# EAGLE design Extruder_Board2.0.0 (EAGLE 9.3.0)
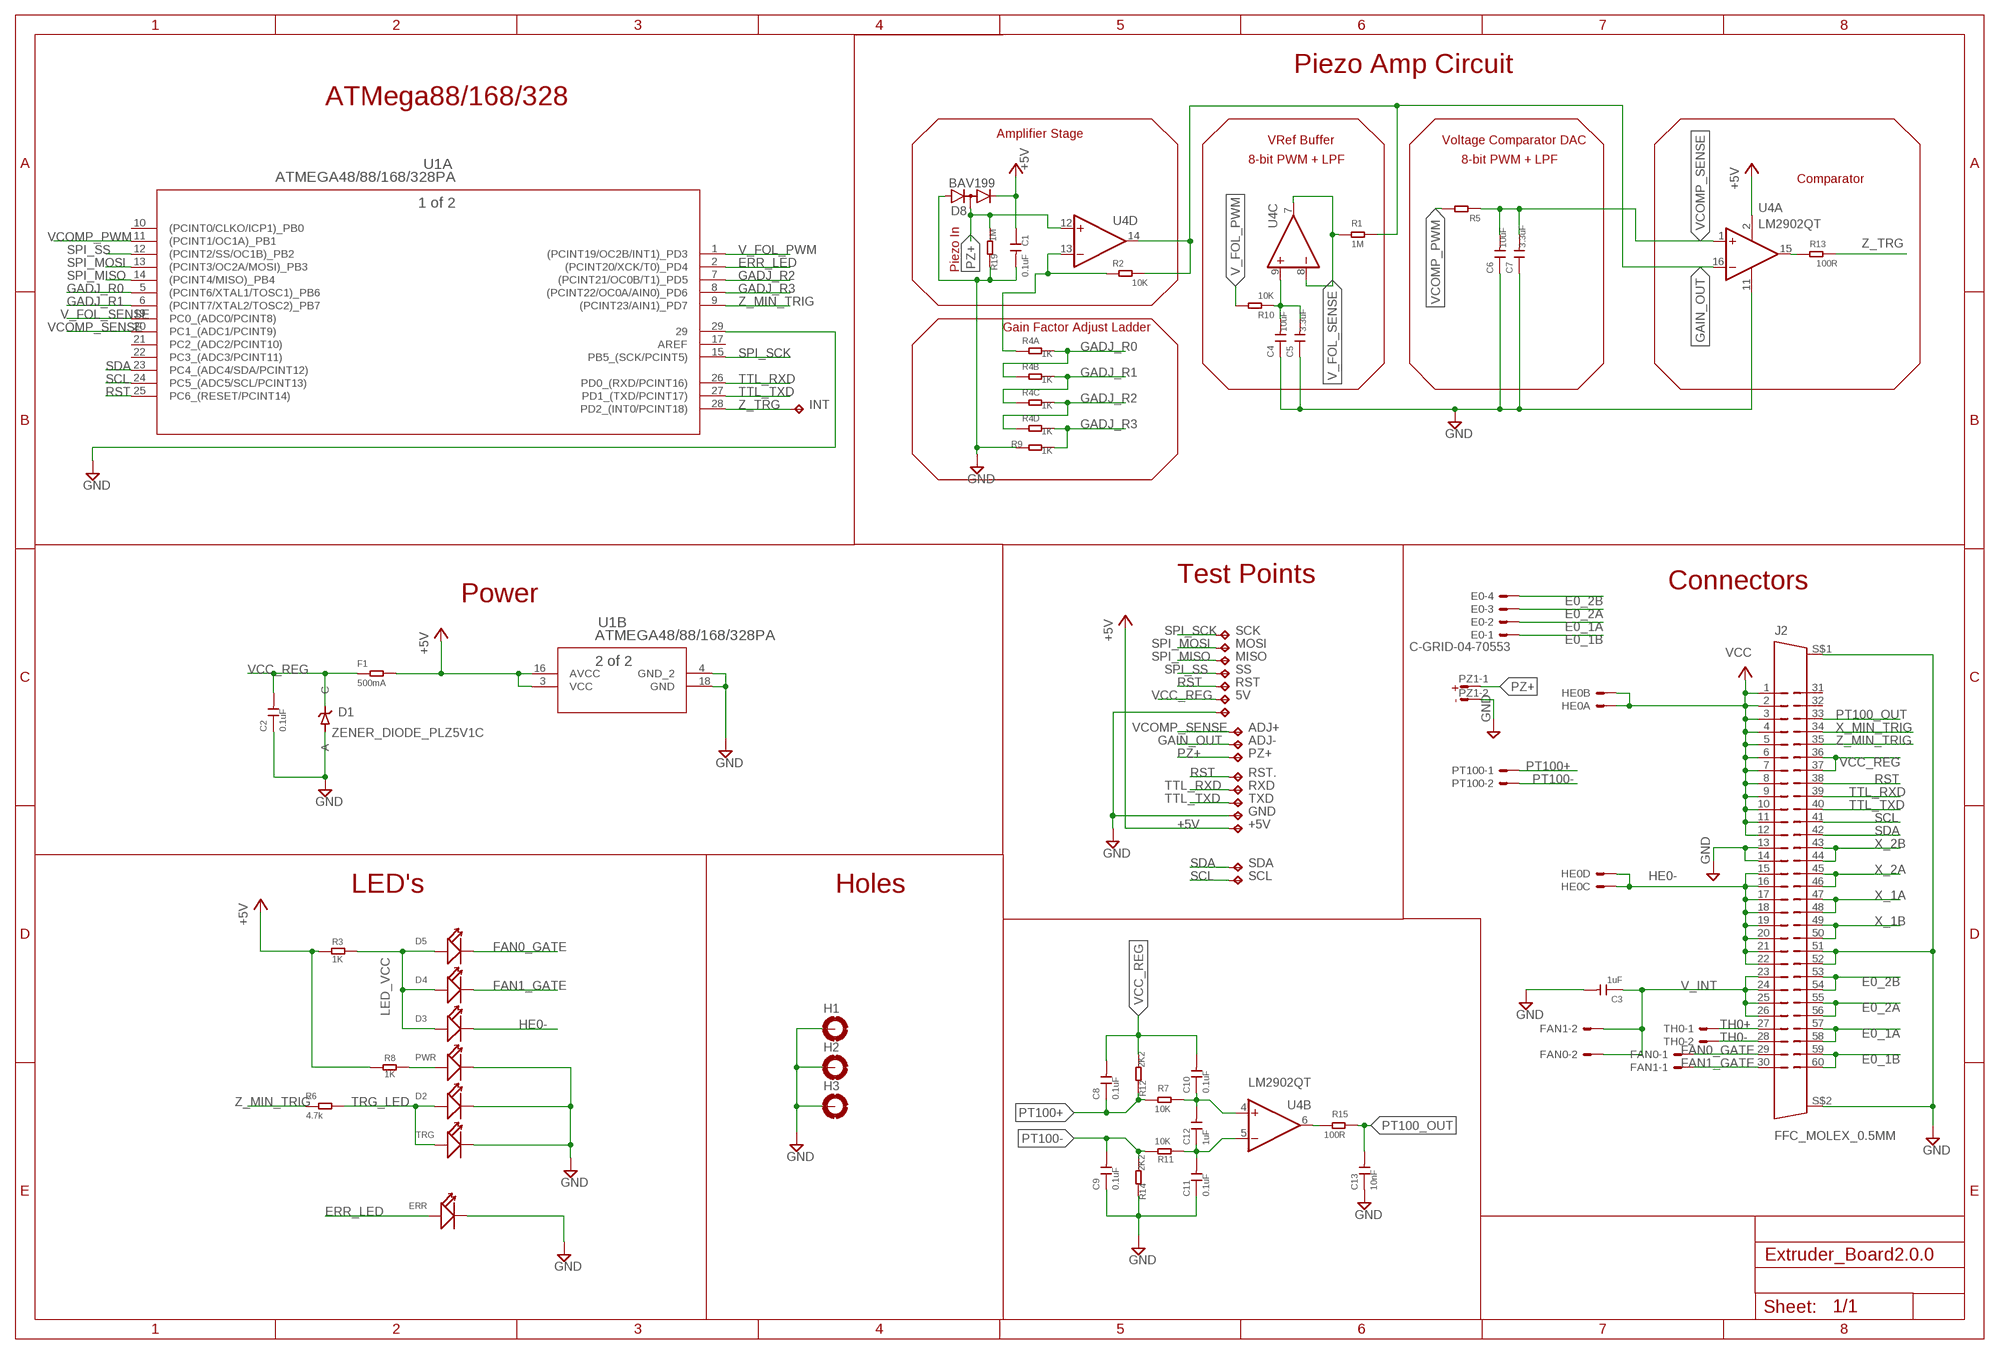
[diagram p0: schematic, sheet 1]

## Parts
5V  TPTP13SQ  [TP13SQ]
+5V  TPTP13SQ  [TP13SQ]
ADJ+  TPTP13SQ  [TP13SQ]
ADJ-  TPTP13SQ  [TP13SQ]
C1  0.1uF  CERAMIC-1NF-50V-10%-X7R(0402)CAP_0402  [CAPC1005X50]
C2  0.1uF  CERAMIC-1NF-50V-10%-X7R(0402)CAP_0402  [CAPC1005X50]
C3  1uF  SEEED-CAPACITOR_CERAMIC-10UF-25V-10%-X5R(0805)CAP_0603_GEN  [CAPC1609X80]
C4  10uF  CERAMIC-1NF-50V-10%-X7R(0402)CAP_0402  [CAPC1005X50]
C5  3.3uF  SEEED-CAPACITOR_CERAMIC-10UF-25V-10%-X5R(0805)CAP_0603_GEN  [CAPC1609X80]
C6  10uF  CERAMIC-1NF-50V-10%-X7R(0402)CAP_0402  [CAPC1005X50]
C7  3.3uF  SEEED-CAPACITOR_CERAMIC-10UF-25V-10%-X5R(0805)CAP_0603_GEN  [CAPC1609X80]
C8  0.1uF  CERAMIC-1NF-50V-10%-X7R(0402)CAP_0402  [CAPC1005X50]
C9  0.1uF  CERAMIC-1NF-50V-10%-X7R(0402)CAP_0402  [CAPC1005X50]
C10  0.1uF  CERAMIC-1NF-50V-10%-X7R(0402)CAP_0402  [CAPC1005X50]
C11  0.1uF  CERAMIC-1NF-50V-10%-X7R(0402)CAP_0402  [CAPC1005X50]
C12  1uF  CERAMIC-1NF-50V-10%-X7R(0402)CAP_0402  [CAPC1005X50]
C13  10nF  CERAMIC-1NF-50V-10%-X7R(0402)CAP_0402  [CAPC1005X50]
D1  ZENER_DIODE_PLZ5V1C  [DO-219AC]
D2  SEEED-LED_SMD-LED-CLEAR-BLUE(0603)LED_0603  [SEEED-LED_LED-0603]
D3  SEEED-LED_SMD-LED-CLEAR-BLUE(0603)LED_0603  [SEEED-LED_LED-0603]
D4  SEEED-LED_SMD-LED-CLEAR-BLUE(0603)LED_0603  [SEEED-LED_LED-0603]
D5  SEEED-LED_SMD-LED-CLEAR-BLUE(0603)LED_0603  [SEEED-LED_LED-0603]
D8  BAV199  [SOT23]
E0  C-GRID-04-70553  [70553-04]
ERR  SEEED-LED_SMD-LED-CLEAR-BLUE(0603)LED_0603  [SEEED-LED_LED-0603]
F1  500mA  SEEED-RESISTOR_SMD-RES-1.5K-1%-1/10W(0603)DETAILED_MODEL  [SEEED-RESISTOR_R0603]
FAN0  CON-MOLEX-2P-1.27MM048  [53048-02]
FAN1  CON-MOLEX-2P-1.27MM048  [53048-02]
GND  TPTP13SQ  [TP13SQ]
H1  HOLES_MOUNT-PAD-ROUND3.2  [HOLES_3,2-PAD]
H2  HOLES_MOUNT-PAD-ROUND3.2  [HOLES_3,2-PAD]
H3  HOLES_MOUNT-PAD-ROUND3.2  [HOLES_3,2-PAD]
HE0  JST-2.54-2X2JST-DUPONT-2.54-2X2  [HDRRAR4W64P254_2X2_556X736X556B]
INT  TPTP06R  [TP06R]
J2  FFC_MOLEX_0.5MM  [FFC-60P_0.5_MOLEX_505110-6091]
MISO  TPTP13SQ  [TP13SQ]
MOSI  TPTP13SQ  [TP13SQ]
PT100  CON-MOLEX-2P-1.27MM048  [53048-02]
PWR  SEEED-LED_SMD-LED-CLEAR-BLUE(0603)LED_0603  [SEEED-LED_LED-0603]
PZ1  CON-MOLEX-2P-1.27MM048  [53048-02]
PZ+  TPTP13SQ  [TP13SQ]
R1  1M  SMD-RES-0R-5%-1/16W(0402)  [R0402]
R2  10K  SMD-RES-0R-5%-1/16W(0402)  [R0402]
R3  1K  SMD-RES-0R-5%-1/16W(0402)  [R0402]
R4  1K  RESISTOR_NETWORK_X40804  [EXBN8V]
R5  10K  SEEED-RESISTOR_SMD-RES-1.5K-1%-1/10W(0603)DETAILED_MODEL  [SEEED-RESISTOR_R0603]
R6  4.7k  SMD-RES-0R-5%-1/16W(0402)  [R0402]
R7  10K  SMD-RES-0R-5%-1/16W(0402)  [R0402]
R8  1K  SMD-RES-0R-5%-1/16W(0402)  [R0402]
R9  1K  SMD-RES-0R-5%-1/16W(0402)  [R0402]
R10  10K  SMD-RES-0R-5%-1/16W(0402)  [R0402]
R11  10K  SMD-RES-0R-5%-1/16W(0402)  [R0402]
R12  2K2  SMD-RES-0R-5%-1/16W(0402)  [R0402]
R13  100R  SMD-RES-0R-5%-1/16W(0402)  [R0402]
R14  2K2  SMD-RES-0R-5%-1/16W(0402)  [R0402]
R15  100R  SMD-RES-0R-5%-1/16W(0402)  [R0402]
R19  1M  SMD-RES-0R-5%-1/16W(0402)  [R0402]
RST  TPTP13SQ  [TP13SQ]
RST.  TPTP13SQ  [TP13SQ]
RXD  TPTP13SQ  [TP13SQ]
SCK  TPTP13SQ  [TP13SQ]
SCL  TPTP13SQ  [TP13SQ]
SDA  TPTP13SQ  [TP13SQ]
SS  TPTP06R  [TP06R]
TH0  CON-MOLEX-2P-1.27MM048  [53048-02]
TRG  SEEED-LED_SMD-LED-CLEAR-BLUE(0603)LED_0603  [SEEED-LED_LED-0603]
TXD  TPTP13SQ  [TP13SQ]
U1  ATMEGA48/88/168/328PA  [28M1]
U4  LM2902QT  [QFN16]
⏚  TPTP13SQ  [TP13SQ]

## Nets
+5V: +5V.TP C1.1 D8.2(C) F1.2 R3.1 R8.1 U1.3(B:VCC) U1.16(B:AVCC) U4.2(P:V+)
E0_1A: E0.2 J2.57 J2.58
E0_1B: E0.1 J2.59 J2.60
E0_2A: E0.3 J2.55 J2.56
E0_2B: E0.4 J2.53 J2.54
ERR_LED: ERR.+ U1.2(A:(PCINT20/XCK/T0)_PD4)
FAN0_GATE: D5.- FAN0.1 J2.29
FAN1_GATE: D4.- FAN1.1 J2.30
GADJ_R0: R4.2 R4.8 U1.5(A:(PCINT6/XTAL1/TOSC1)_PB6)
GADJ_R1: R4.3 R4.7 U1.6(A:(PCINT7/XTAL2/TOSC2)_PB7)
GADJ_R2: R4.4 R4.6 U1.7(A:(PCINT21/OC0B/T1)_PD5)
GADJ_R3: R4.5 R9.2 U1.8(A:(PCINT22/OC0A/AIN0)_PD6)
GAIN_FB: R2.1 R4.1 U4.13(D:-IN)
GAIN_OUT: ADJ-.TP R1.2 R2.2 U4.14(D:OUT) U4.16(A:-IN)
GND: C1.2 C2.1 C3.2 C4.1 C5.1 C6.1 C7.1 C9.1 C11.1 C13.1 D1.P$1(A) D2.- D8.1(A) ERR.- GND.TP H1.B3,2(MOUNT) H2.B3,2(MOUNT) H3.B3,2(MOUNT) J2.13 J2.14 J2.51 J2.52 J2.S$1(S) J2.S$2(S) PWR.- PZ1.2 R9.1 R14.1 R19.1 TRG.- U1.4(B:GND_2) U1.18(B:GND) U1.29 U4.11(P:V-) ⏚.TP
HE0-: D3.- HE0.3 HE0.4 J2.15 J2.16 J2.17 J2.18 J2.19 J2.20 J2.21 J2.22
LED_VCC: D3.+ D4.+ D5.+ R3.2
N$2: PWR.+ R8.2
PT100+: C8.1 PT100.1 R7.2 R12.1
PT100-: C9.2 PT100.2 R11.2 R14.2
PT100_AMP+: C10.1 C12.2 R7.1 U4.4(B:+IN)
PT100_AMP-: C11.2 C12.1 R11.1 U4.5(B:-IN)
PT100_OUT: C13.2 J2.33 R15.1
PT100_R: R15.2 U4.6(B:OUT)
PZ+: D8.3(AC) PZ1.1 PZ+.TP R19.2 U4.12(D:+IN)
PZ_AMP_OUT: R13.1 U4.15(A:OUT)
RST: J2.38 RST..TP RST.TP U1.25(A:PC6_(RESET/PCINT14))
SCL: J2.41 SCL.TP U1.24(A:PC5_(ADC5/SCL/PCINT13))
SDA: J2.42 SDA.TP U1.23(A:PC4_(ADC4/SDA/PCINT12))
SPI_MISO: MISO.TP U1.14(A:(PCINT4/MISO)_PB4)
SPI_MOSI: MOSI.TP U1.13(A:(PCINT3/OC2A/MOSI)_PB3)
SPI_SCK: SCK.TP U1.15(A:PB5_(SCK/PCINT5))
SPI_SS: SS.TP U1.12(A:(PCINT2/SS/OC1B)_PB2)
TH0+: J2.27 TH0.1
TH0-: J2.28 TH0.2
TRG_LED: D2.+ R6.2 TRG.+
TTL_RXD: J2.39 RXD.TP U1.26(A:PD0_(RXD/PCINT16))
TTL_TXD: J2.40 TXD.TP U1.27(A:PD1_(TXD/PCINT17))
V_FOL_PWM: R10.2 U1.1(A:(PCINT19/OC2B/INT1)_PD3)
V_FOL_SENSE: R1.1 U1.19(A:PC0_(ADC0/PCINT8)) U4.7(C:OUT) U4.8(C:-IN)
V_INT: C3.1 FAN0.2 FAN1.2 J2.23 J2.24 J2.25 J2.26
VCC: HE0.1 HE0.2 J2.1 J2.2 J2.3 J2.4 J2.5 J2.6 J2.7 J2.8 J2.9 J2.10 J2.11 J2.12
VCC_REG: 5V.TP C2.2 C8.2 C10.2 D1.P$2(C) F1.1 J2.36 J2.37 R12.2
VCOMP_PWM: R5.2 U1.11(A:(PCINT1/OC1A)_PB1)
VCOMP_SENSE: ADJ+.TP C6.2 C7.2 R5.1 U1.20(A:PC1_(ADC1/PCINT9)) U4.1(A:+IN)
VREF_IN: C4.2 C5.2 R10.1 U4.9(C:+IN)
X_1A: J2.47 J2.48
X_1B: J2.49 J2.50
X_2A: J2.45 J2.46
X_2B: J2.43 J2.44
X_MIN_TRIG: J2.34
Z_MIN_TRIG: J2.35 R6.1 U1.9(A:(PCINT23/AIN1)_PD7)
Z_TRG: INT.TP R13.2 U1.28(A:PD2_(INT0/PCINT18))
Unconnected: J2.31 J2.32 U1.10(A:(PCINT0/CLKO/ICP1)_PB0) U1.17(A:AREF) U1.21(A:PC2_(ADC2/PCINT10)) U1.22(A:PC3_(ADC3/PCINT11))

## Notes on the sheet
- Piezo Amp Circuit
- ATMega88/168/328
- Amplifier Stage
- VRef Buffer | Voltage Comparator DAC
- 8-bit PWM + LPF | 8-bit PWM + LPF
- Comparator
- Piezo In
- Gain Factor Adjust Ladder
- Test Points | Connectors
- Power
- -  +
- LED's | Holes

## Library data of the parts
5V ADJ+ ADJ- MISO MOSI PZ+ RST SCK = PiezoFFC:TP: Test pad
+5V GND INT RST. RXD SCL SDA SS TXD ⏚ = testpad:TP: Test pad
C1 C2 C4 C6 C8-C13 = PiezoFFC:CERAMIC-1NF-50V-10%-X7R(0402): 302010005
C3 C5 C7 = PiezoFFC:SEEED-CAPACITOR_CERAMIC-10UF-25V-10%-X5R(0805): 302010178
D1 = PiezoFFC:ZENER_DIODE_PLZ5V1C
D2-D5 ERR PWR TRG = PiezoFFC:SEEED-LED_SMD-LED-CLEAR-BLUE(0603): 304090045
D8 = PiezoFFC:BAV199: DIODE low-leakage double diode
E0 = PiezoFFC:C-GRID-04: CONNECTOR wire to board 2.54 mm (0.100") pitch header; MF: MOLEX; OC_FARNELL: unknown; OC_NEWARK: unknown
F1 R5 = PiezoFFC:SEEED-RESISTOR_SMD-RES-1.5K-1%-1/10W(0603): 301010189
FAN0 FAN1 PT100 PZ1 TH0 = PiezoFFC:CON-MOLEX-2P-1.27MM: CONNECTOR wire to board 1.25 mm (.049 inch) pitch header; MF: MOLEX; MPN: 53048-0210; OC_FARNELL: 1012259; OC_NEWARK: 57H4718
H1-H3 = PiezoFFC:HOLES_MOUNT-PAD-ROUND: MOUNTING PAD, round
HE0 = PiezoFFC:JST-2.54-2X2
J2 = PiezoFFC:FFC_MOLEX_0.5MM
R1-R3 R6-R15 R19 = PiezoFFC:SMD-RES-0R-5%-1/16W(0402): 301010000; MPN: RC0402JR-070RL; VALUE: 0R
R4 = PiezoFFC:RESISTOR_NETWORK_X4
U1 = PiezoFFC:ATMEGA48/88/168/328PA; MANUFACTURER_PART_NUMBER: ATMEGA48PAMMHR; VENDOR: Atmel
U4 = PiezoFFC:LM2902: Low power quad operational amplifier Source: Data sgeet <http://www.st.com/internet/com/TECHNICAL_RESOURCES/TECHNICAL_LITERATURE/DATASHEET/CD00000533.pdf>

## Board
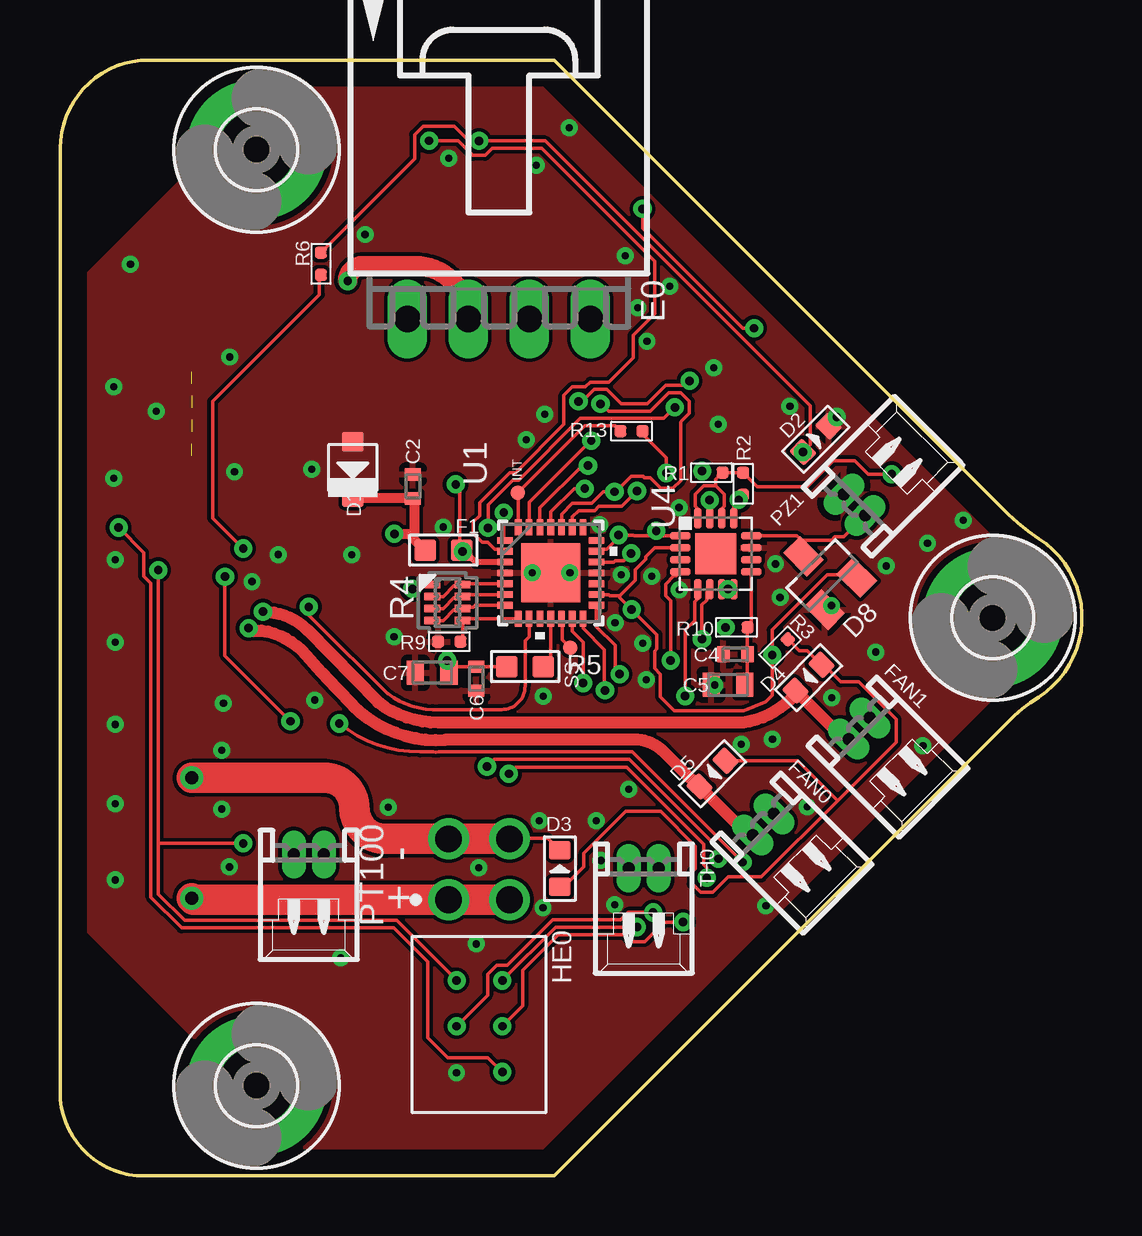
[diagram p1: board, top side]
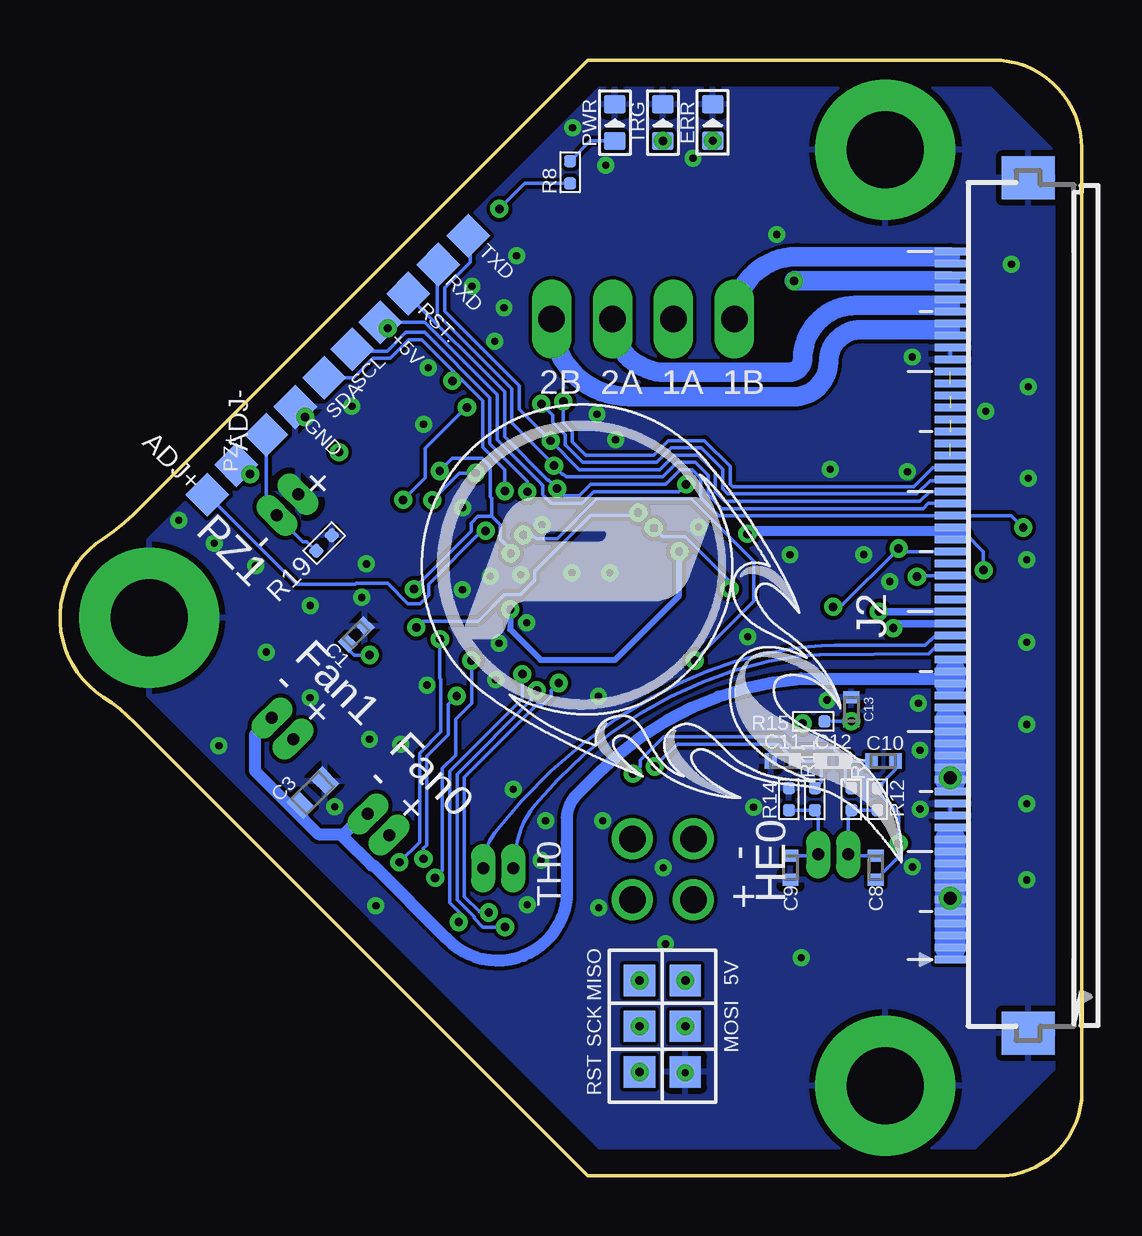
[diagram p2: board, bottom side, seen from below]

Size 42.58 x 46.48 mm. Coordinates in mm from the lower left corner, seen from the top.
Outline: 22.46,1.87 39.46,18.87 arc-12 40.78,19.94 arc114 40.78,26.54 arc-12 39.51,27.56 20.59,46.48 8.14,46.48 3.7,46.48 arc90 0.01,42.8 0.01,3.81 arc90 3.19,0 8.27,0 20.59,0 22.46,1.87
Copper layers (1*16): Top 0.035mm / dielectric 1.5mm / Bottom 0.035mm
Design rules "default *": minimum track width 6mil, minimum drill 0.35mm, track to track 6mil, track to pad 6mil, pad to pad 6mil, via to via 6mil, smd to smd 6mil, copper to edge 40mil, drill to drill 6mil, minimum pad ring 10mil, minimum via ring 8mil, stop-mask expansion 4mil, vias tented up to drill 4mm, thermal gap 10mil

### Footprints (pad centres in the part's own frame; a part is rotated, then mirrored left to right if it is on the bottom)
TP13SQ = smd 1.3 x 1.3: TP 0,0
CAPC1005X50 = smd 0.512 x 0.662: 1 -0.5,0; 2 0.5,0
CAPC1609X80 = smd 0.712 x 1.012: 1 -0.7,0; 2 0.7,0
DO-219AC = smd 0.8 x 0.9: P$1 -1.15,0; P$2 1.15,0
SEEED-LED_LED-0603 = smd 0.762 x 0.889: + -0.762,0; - 0.762,0
SOT23 = smd 1 x 1.4: 1 -0.95,-1.1; 2 0.95,-1.1; 3 0,1.1
70553-04 = drill 1.092 long: 1 -3.81,-7.62; 2 -1.27,-7.62; 3 1.27,-7.62; 4 3.81,-7.62
SEEED-RESISTOR_R0603 = smd 0.889 x 0.889: 1 0,0.762; 2 0,-0.762
53048-02 = drill 0.5 pad 0.698 long: 1 0.625,-1.25; 2 -0.625,-1.25
HOLES_3,2-PAD = drill 3.2 pad 5.842: B3,2 0,0
HDRRAR4W64P254_2X2_556X736X556B = drill 1.105 pad 1.705: 1 0,0; 2 2.54,0; 3 2.54,2.54; 4 0,2.54
TP06R = smd 0.6 x 0.6: TP 0,0
FFC-60P_0.5_MOLEX_505110-6091 = smd 0.3 x 1.3: 1 -14.75,3.25; 2 -14.25,3.25; 3 -13.75,3.25; 4 -13.25,3.25; 5 -12.75,3.25; 6 -12.25,3.25; 7 -11.75,3.25; 8 -11.25,3.25; 9 -10.75,3.25; 10 -10.25,3.25; 11 -9.75,3.25; 12 -9.25,3.25; 13 -8.75,3.25; 14 -8.25,3.25; 15 -7.75,3.25; 16 -7.25,3.25; 17 -6.75,3.25; 18 -6.25,3.25; 19 -5.75,3.25; 20 -5.25,3.25; 21 -4.75,3.25; 22 -4.25,3.25; 23 -3.75,3.25; 24 -3.25,3.25; 25 -2.75,3.25; 26 -2.25,3.25; 27 -1.75,3.25; 28 -1.25,3.25; 29 -0.75,3.25; 30 -0.25,3.25; 31 0.25,3.25; 32 0.75,3.25; 33 1.25,3.25; 34 1.75,3.25; 35 2.25,3.25; 36 2.75,3.25; 37 3.25,3.25; 38 3.75,3.25; 39 4.25,3.25; 40 4.75,3.25; 41 5.25,3.25; 42 5.75,3.25; 43 6.25,3.25; 44 6.75,3.25; 45 7.25,3.25; 46 7.75,3.25; 47 8.25,3.25; 48 8.75,3.25; 49 9.25,3.25; 50 9.75,3.25; 51 10.25,3.25; 52 10.75,3.25; 53 11.25,3.25; 54 11.75,3.25; 55 12.25,3.25; 56 12.75,3.25; 57 13.25,3.25; 58 13.75,3.25; 59 14.25,3.25; 60 14.75,3.25 | smd 1.8 x 2.2: S$1 17.821,0; S$2 -17.821,0
R0402 = smd 0.5 x 0.5: 1 0,0.463; 2 0,-0.463
EXBN8V = smd 0.657 x 0.3: 1 -0.629,0.75; 2 -0.629,0.25; 3 -0.629,-0.25; 4 -0.629,-0.75; 5 0.629,-0.75; 6 0.629,-0.25; 7 0.629,0.25; 8 0.629,0.75
28M1-L = smd 0.66 x 0.279: 1 -1.905,1.35; 2 -1.905,0.9; 3 -1.905,0.45; 4 -1.905,0; 5 -1.905,-0.45; 6 -1.905,-0.9; 7 -1.905,-1.35; 15 1.905,-1.35; 16 1.905,-0.9; 17 1.905,-0.45; 18 1.905,0; 19 1.905,0.45; 20 1.905,0.9; 21 1.905,1.35 | smd 0.279 x 0.66: 8 -1.35,-1.905; 9 -0.9,-1.905; 10 -0.45,-1.905; 11 0,-1.905; 12 0.45,-1.905; 13 0.9,-1.905; 14 1.35,-1.905; 22 1.35,1.905; 23 0.9,1.905; 24 0.45,1.905; 25 0,1.905; 26 -0.45,1.905; 27 -0.9,1.905; 28 -1.35,1.905 | smd 2.464 x 2.464: 29 0,0
QFN16 = smd 0.85 x 0.3: 1 -1.475,0.75; 2 -1.475,0.25; 3 -1.475,-0.25; 4 -1.475,-0.75; 9 1.475,-0.75; 10 1.475,-0.25; 11 1.475,0.25; 12 1.475,0.75 | smd 0.3 x 0.85: 5 -0.75,-1.475; 6 -0.25,-1.475; 7 0.25,-1.475; 8 0.75,-1.475; 13 0.75,1.475; 14 0.25,1.475; 15 -0.25,1.475; 16 -0.75,1.475 | smd 1.7 x 1.7: TH 0,0

### Placement (x,y rotation side)
5V  16.52,8.13 0 bottom
+5V  29.24,35.56 135 bottom
ADJ+  36.45,28.36 45 bottom
ADJ-  35.23,29.61 225 bottom
C1  30.24,22.54 45 bottom
C2  14.71,28.71 270 top
C3  32.05,15.94 45 bottom
C4  28.14,21.72 0 top
C5  27.83,20.45 0 top
C6  17.35,20.7 90 top
C7  15.51,20.96 0 top
C8  8.59,12.83 270 bottom
C9  12.14,12.83 90 bottom
C10  8.27,17.27 0 bottom
C11  12.46,17.27 0 bottom
C12  10.36,17.27 0 bottom
C13  9.6,19.43 270 bottom
D1  12.2,29.43 270 top
D2  31.49,30.68 45 top
D3  20.83,12.79 90 top
D4  31.19,20.75 225 top
D5  27.19,16.75 225 top
D8  31.75,25.02 45 top
E0  18.29,43.31 0 top
ERR  15.38,43.88 90 bottom
F1  15.97,26.06 90 top
FAN0  30.19,13.75 225 top
FAN1  34.19,17.75 225 top
GND  32.78,32.02 315 bottom
H1  8.19,3.75 0 top
H2  8.19,42.75 0 top
H3  38.86,23.24 0 top
HE0  16.19,11.49 0 top
INT  19.08,28.45 180 top
J2  2.24,23.75 90 bottom
MISO  18.43,8.13 0 bottom
MOSI  16.52,6.22 0 bottom
PT100  10.36,12.13 180 top
PWR  19.46,43.87 90 bottom
PZ1  33.99,28.83 315 top
PZ+  33.99,30.86 45 bottom
R1  27.14,29.29 90 top
R2  28.46,28.83 180 top
R3  30.01,22.02 135 top
R4  16.14,23.88 0 top
R5  19.38,21.21 90 top
R6  10.87,37.99 180 top
R7  9.6,15.68 0 bottom
R8  21.32,41.8 180 bottom
R9  16.22,22.24 90 top
R10  28.19,22.84 270 top
R11  11.13,15.68 0 bottom
R12  8.52,15.68 180 bottom
R13  23.81,31.02 270 top
R14  12.21,15.68 0 bottom
R15  11.19,18.92 270 bottom
R19  31.57,26.35 315 bottom
RST  18.43,4.32 0 bottom
RST.  28.07,36.75 315 bottom
RXD  26.82,37.96 135 bottom
SCK  18.43,6.22 0 bottom
SCL  30.41,34.42 315 bottom
SDA  31.57,33.24 315 bottom
SS  21.27,21.99 90 top
TH0  24.32,11.56 180 top
TRG  17.46,43.87 90 bottom
TXD  25.57,39.16 135 bottom
U1  ATMEGA48PA-MMHR28M1-L  [28M1-L]  20.45,25.11 0 top
U4  27.32,25.91 0 top
U$1  [LOGO-PYR0BALL-SS-20MM]  20.73,25.51 0 bottom
⏚  16.52,4.32 0 bottom

### Tracks (layer width: path | path; a pad name or v marks a point on that pad's centre or on a via)
+5V  (via drill 0.35)
  Top 0.152: 28.84,35.31 v28.92,35.31 28.45,35.31 24.27,39.48 v24.27,40.28 | D8.2 33.08,25.04 31.98,25.04 29.68,22.74 R3.1 29.68,20.01 29.41,19.75 28.49,19.37 25.6,19.37 25.01,19.96 25.01,20.9 24.78,21.13 24.78,21.85 24.87,21.94 24.87,22.54 v23.82,23.59 23.33,24.08 | U1.16 22.86,24.21 22.91,24.15 23.25,24.15 23.33,24.08 | v16.49,28.8 16.65,28.64 16.65,26.06 | U4.2 24.78,26.16 24.4,25.79 24.4,25.67 23.96,25.23 23.96,24.8 23.33,24.16 23.33,24.08
  Top 0.254: U1.3 17.32,25.56 16.82,26.06 F1.2 | F1.2 16.65,26.06 | v16.78,26 F1.2
  Bottom 0.152: 22.49,28.79 24.36,30.65 24.36,32.53 27.39,35.56 28.67,35.56 v28.92,35.31 28.99,35.31 +5V.TP | v24.27,40.28 23.22,41.34 R8.1 | 29.59,21.69 R3.1 30.32,21.69 30.61,21.98 30.61,22.17 C1.1 | 22.49,28.79 22.5,28.78 | 22.49,28.79 22.47,28.77 22.47,28.37 22.12,28.02 20.82,28.02 20.33,28.5 16.79,28.5 v16.49,28.8
  Bottom 0.254: v23.82,23.59 23.82,22.76 22.55,21.49 19.45,21.49 16.78,24.16 v16.78,26
  other vias: 29.68,21.69
E0_1A  (via drill 0.35)
  Top 0.813: E0.2 arc90 14.79,37.91 12.62,37.91 arc90 v11.99,37.27
  Bottom 0.152: J2.57 5.49,37.27 J2.58
  Bottom 0.813: v11.99,37.27 arc-90 v11.99,37.27 5.49,37.27
E0_1B
  Bottom 0.152: J2.59 5.49,38.29 J2.60
  Bottom 0.813: E0.1 arc90 11.87,38.29 5.49,38.29
E0_2A
  Bottom 0.152: J2.55 5.49,36.26 J2.56
  Bottom 0.813: E0.3 arc-90 17.34,33.46 12.21,33.46 arc-90 11.63,34.04 arc90 9.41,36.26 5.49,36.26
E0_2B
  Bottom 0.152: J2.53 5.49,35.24 J2.54
  Bottom 0.813: E0.4 arc-90 18.86,32.45 12.02,32.45 arc-90 10.56,33.91 arc90 9.22,35.24 5.49,35.24
ERR_LED  (via drill 0.35)
  Top 0.152: ERR.+ 16.6,43.12 17.21,42.5 17.71,42.5 18.01,42.81 20.07,42.81 24.78,38.1 24.78,35.91 23.88,35.01 23.88,34.07 22.87,33.06 22.09,33.06 21.89,32.86 21.35,32.86 21,32.51 21,31.3 18.99,29.28 18.73,29.28 17.48,28.04 17.48,27.49 17.23,27.24 17.23,26.74 17.58,26.38 17.83,26.38 18.12,26.09 18.46,26.09 U1.2
  other vias: 15.38,43.12
FAN0_GATE  (via drill 0.35)
  Top 0.508: FAN0.1 28.67,14.19 D5.- 26.18,16.64 25.16,17.65 arc50 23.76,18.16 16.08,18.16 arc-49 12.2,19.59 arc-5 10.25,21.69 arc41 8.4,22.71 7.86,22.71 v7.86,22.81
  Bottom 0.305: J2.29 7.67,23 v7.86,22.81
FAN1_GATE  (via drill 0.35)
  Top 0.508: FAN1.1 32.67,18.19 D4.- 30.65,20.06 30.46,19.87 arc-37 28.46,18.87 15.77,18.87 arc-37 13.26,19.71 arc1 10.3,22.74 arc45 v8.46,23.5
  Bottom 0.305: J2.30 6.49,23.5 arc0 v8.46,23.5
GADJ_R0
  Top 0.152: U1.5 16.81,24.66 R4.8 16.71,24.57 16.41,24.57 15.97,24.13 R4.2
GADJ_R1
  Top 0.152: U1.6 18.52,24.19 16.84,24.19 R4.7 16.71,24.07 16.41,24.07 15.97,23.63 R4.3
GADJ_R2
  Top 0.152: U1.7 17.3,23.76 17.23,23.69 16.84,23.69 R4.6 16.71,23.57 16.41,23.57 15.97,23.13 R4.4
GADJ_R3
  Top 0.152: U1.8 16.85,23.21 R4.5 16.77,22.34 R9.2
GAIN_FB  (via drill 0.35)
  Top 0.152: U4.13 28.07,27.97 R2.1 28.46,28.33 v28.28,28.15 | v25.62,32.01 25.16,31.55 21.68,31.55 19.11,28.98 18.86,28.98 17.84,27.96 v17.84,26.99 | R4.1 14.86,24.63 v14.68,24.45
  Bottom 0.152: v28.28,28.15 27.36,29.07 27.36,30.3 25.65,32.01 v25.62,32.01 | v17.84,26.99 17.46,26.61 16.53,26.61 14.71,24.8 14.71,24.48 v14.68,24.45
GAIN_OUT  (via drill 0.35)
  Top 0.152: 27.32,28.75 26.82,28.75 26.46,28.39 26.46,27.89 26.57,27.78 U4.16 | 27.32,28.75 27.68,28.39 27.68,27.89 27.57,27.78 U4.14 | 27.32,28.75 27.32,29 R1.2 R2.2 29.05,28.7 31.13,28.7 32.21,29.78 33.12,29.78 33.67,29.23 v34.66,29.23
  Bottom 0.152: ADJ-.TP 35.04,29.61 v34.66,29.23
GND  (via drill 0.3, 0.35)
  Bottom 0.152: J2.13 J2.14 | J2.52 J2.51
  other vias: 23.38,25.04 27.43,31.31 23.56,38.33 21.25,25.12 10.49,29.43 35.96,17.91 29.68,18.18 2.94,37.97 36.15,26.35 2.3,25.65 2.3,22.23 2.3,18.8 2.3,15.49 2.3,12.32 11.7,9.08 6.75,17.72 8,24.75 15.97,27.02 12.16,25.86 20.2,31.72 19.97,14.78 24.29,22.18 22.35,14.78 21.22,43.66 28.38,17.97 24.43,20.66 31.13,15.37 29.41,11.24 23.13,23.03 27.29,20.44 17.44,12.83 37.64,27.3 19.84,42.1 27.24,33.65 30.41,32.05 19.67,25.12 32.16,19.91 7.07,34.11 7.27,29.33 32.37,31.61 19.43,30.66 34.43,25.4 22.49,27.11 32.15,23.75 24.65,24.98 25.79,27.83 29.81,25.49 30,24.09 25.81,24.41 9.09,25.88 4.01,31.85 13.92,22.45 20.14,19.97 23.7,16.1 6.74,15.27 7.06,12.86 24.46,34.77 16.2,42.39 12.71,39.21 33.98,21.81 6.81,19.69 10.62,19.81 24.08,36.16 25.41,37.05 2.23,29.05 2.23,32.86 16.52,4.29 17.35,9.65 22.54,13.13 23.11,11.29 20.12,11.16 13.68,15.35
  pour Top: 1.01,37.43 1.01,10.32 10.46,0.87 20.46,0.87 39.46,19.87 39.46,26.87 20.46,45.87 9.46,45.87
  pour Bottom: 1.01,42.51 1.01,4.6 4.47,1.14 20.08,1.14 39.26,20.32 39.26,26.16 20.08,45.34 3.84,45.34
HE0-  (via drill 0.55)
  Top 0.152: D3.- 20.32,14.06 18.76,14.06 HE0.3
  Top 1.27: HE0.3 HE0.4 13.54,14.03 arc-90 12.27,15.3 arc90 11,16.57 v5.49,16.57
  Bottom 0.152: J2.15 J2.16 | v5.49,16.57 J2.17 J2.18 J2.19 J2.20 J2.21 J2.22
  Bottom 1.27: J2.16 v5.49,16.57 J2.21
LED_VCC
  Top 0.152: D5.+ 30.74,17.29 32.4,15.62 | 32.4,15.62 34.84,18.06 34.84,19.02 33.28,20.57 32.53,20.57 31.82,21.29 D4.+ 31.14,21.87 30.81,21.87 R3.2 | 32.4,15.62 29.22,12.45 27.85,12.45 27.2,11.8 26.7,11.8 26.34,12.15 26.34,12.65 26.47,12.79 26.47,13.73 25.02,15.18 23.57,15.18 21.83,13.43 21.83,12.86 21,12.03 D3.+
N$2
  Bottom 0.152: 19.21,42.86 PWR.+ 20.48,43.11 R8.2
PT100+
  Bottom 0.152: C8.1 9.69,13.33 PT100.1 9.74,15.08 R7.2 R12.1
PT100-
  Bottom 0.152: C9.2 11.04,13.33 PT100.2 10.99,15.08 R11.2 R14.2
PT100_AMP+  (via drill 0.35)
  Top 0.152: U4.4 25.67,24.99 25.57,24.99 25.23,24.65 25.23,24.17 25.44,23.95 v25.44,21.46 | v26.95,12.4 26.95,12.83 26.83,12.95 26.83,13.81 23.61,17.02 18.98,17.02 v18.7,16.74
  Bottom 0.152: R7.1 9.86,16.41 C12.2 | C12.2 C10.1 | v25.44,21.46 25.41,21.44 25.41,19.69 26.1,19 26.1,17.52 26.65,16.97 26.65,12.7 v26.95,12.4 | v18.7,16.74 18.4,17.04 18.4,17.3 17.42,18.28 12.52,18.28 12.08,17.83 10.39,17.83 9.86,17.31 C12.2
PT100_AMP-  (via drill 0.35)
  Top 0.152: U4.5 26.57,24.03 26.44,23.91 26.44,23.13 26.05,22.73 v26.05,19.98 | v27.43,13.2 27.43,13.63 23.72,17.35 18.1,17.35 v17.79,17.05
  Bottom 0.152: R11.1 10.86,16.41 C12.1 C11.2 12.65,17.97 16.87,17.97 v17.79,17.05 | v26.05,19.98 26.4,19.63 26.4,18.37 27.29,17.48 27.29,13.77 27.43,13.63 v27.43,13.2
PT100_OUT  (via drill 0.35)
  Top 0.152: C13.2 6.87,21.66 v6.87,24.96
  Bottom 0.152: R15.1 C13.2 | v6.87,24.96 6.83,25 J2.33
  other vias: 9.6,18.93
PT100_R  (via drill 0.35)
  Top 0.152: U4.6 26.95,24.31 26.95,23.98 26.75,23.78 v26.75,22.35 | v28.44,13.06 23.84,17.65 15.77,17.65 15.65,17.64 15.55,17.65 15,17.65 arc-39 v11.64,18.84
  Bottom 0.152: v26.75,22.35 26.75,20.72 26.71,20.68 26.71,18.5 27.6,17.61 27.6,13.89 v28.44,13.06 | R15.2 11.65,18.86 v11.64,18.84
PZ+
  Top 0.152: 30.85,25.93 D8.3 30.88,25.9 30.88,26.48 | U4.12 30.7,26.66 30.88,26.48 | 30.88,26.48 32.15,26.48 32.29,26.62 32.66,26.62 PZ1.1
  Bottom 0.152: R19.2 32.29,26.42 32.46,26.42 PZ1.1 33.99,27.95 PZ+.TP
PZ_AMP_OUT  (via drill 0.35)
  Top 0.152: U4.15 v27.07,28.14 | v25.26,29.27 25.26,29.91 24.27,30.9 R13.1
  Bottom 0.152: v27.07,28.14 25.94,29.27 v25.26,29.27
RST  (via drill 0.35)
  Top 0.152: U1.25 20.45,27.65 21.42,28.62 v21.86,28.62 | 21.88,28.62 v21.86,28.62 | 21.9,28.61 21.88,28.62 v21.86,28.62 | RST.TP 17.83,4.92 16.15,4.92 15.32,5.75 15.32,8.9 13.9,10.32 5.07,10.32 3.79,11.6 3.79,24.67 3.49,24.97 3.49,25.96 v2.44,27
  Bottom 0.152: 28.12,36.81 RST..TP 28.07,36.67 24.06,32.66 24.06,30.78 22.25,28.97 22.22,28.97 v21.86,28.62 21.56,28.32 20.94,28.32 20.46,28.8 17.34,28.8 16.74,29.41 16.24,29.41 15.88,29.05 15.88,28.24 15.13,27.49 5.5,27.49 J2.38 2.94,27.5 v2.44,27
  other vias: 18.43,4.32
SCL  (via drill 0.35)
  Top 0.152: U1.24 20.9,27.55 21.35,28.01 22.15,28.01 22.63,28.49 v23.1,28.49 23.15,28.49 23.79,29.13 24.3,29.13 24.35,29.08 24.59,29.08 25.03,28.64 25.54,28.64 25.86,28.96 25.86,29.02 25.87,29.02 25.87,29.53 25.86,29.53 25.86,31.39 25.91,31.44 26.23,31.76 26.23,32.26 25.87,32.62 25.37,32.62 24.6,31.85 22.87,31.85 22.57,32.15 v22.52,32.15
  Bottom 0.152: SCL.TP 30.33,34.35 28.95,34.35 28.18,35.13 27.39,35.13 24.67,32.4 24.67,30.5 23.1,28.94 v23.1,28.49 | v22.52,32.15 22.05,31.68 22.05,31.39 21.53,30.87 21.53,30.44 20.81,29.72 17.72,29.72 17.12,30.32 15.86,30.32 14.97,29.43 14.97,28.61 14.76,28.4 6.87,28.4 6.32,28.96 5.53,28.96 J2.41
SDA  (via drill 0.35)
  Top 0.152: U1.23 21.35,27.44 21.61,27.7 22.27,27.7 22.45,27.88 23.4,27.88 v24.04,28.53 | v26.23,33.11 26.04,32.92 25.24,32.92 24.48,32.16 23.38,32.16 22.77,32.76 22.27,32.76 21.91,32.4 21.91,32.36 21.71,32.16 v21.6,32.26
  Bottom 0.152: SDA.TP 30.35,33.24 29.54,34.05 28.83,34.05 28.05,34.82 27.51,34.82 25.81,33.11 | v24.04,28.53 24.04,29.41 24.97,30.34 24.97,32.28 25.81,33.11 | 25.81,33.11 v26.23,33.11 | v21.6,32.26 21.6,31.37 21.23,31 21.23,30.57 20.68,30.02 17.85,30.02 17.24,30.63 15.73,30.63 14.66,29.56 14.66,28.81 14.56,28.71 7,28.71 6.21,29.5 J2.42
SPI_MISO  (via drill 0.35)
  Top 0.152: U1.14 21.8,22.8 22.68,21.91 22.68,20.24 v22.71,20.22 | v24.04,10.36 23.5,10.36 | 23.5,10.36 | 23.5,10.36 20.66,10.36 MISO.TP
  Bottom 0.152: v22.71,20.22 22.94,19.99 22.94,19.82 26.04,16.72 26.04,11.49 25.32,10.78 25.32,10.71 24.97,10.36 v24.04,10.36
  other vias: 18.43,8.13
SPI_MOSI  (via drill 0.35)
  Top 0.152: U1.13 21.35,22.67 21.8,22.22 v21.8,20.53 | v24.72,10.96 23.68,10.96 23.38,10.66 20.53,10.66 18.63,8.76 18.21,8.76 17.82,8.38 17.82,7.52 MOSI.TP
  Bottom 0.152: v21.8,20.53 22.1,20.23 22.1,19.97 22.46,19.61 22.72,19.61 25.73,16.59 25.73,11.62 25.1,10.99 24.72,10.99 v24.72,10.96
  other vias: 16.52,6.22
SPI_SCK  (via drill 0.35)
  Top 0.152: U1.15 22.35,22.87 23.13,22.1 23.13,21.08 v23.32,20.89 | v25.96,10.56 25.17,10.56 24.36,9.75 23.79,9.75 23.51,10.03 20.76,10.03 19.28,8.55 19.28,7.07 SCK.TP
  Bottom 0.152: v23.32,20.89 23.32,19.87 26.34,16.85 26.34,11.37 25.91,10.93 25.91,10.62 v25.96,10.56
  other vias: 18.43,6.22
SPI_SS
  Top 0.152: SS.TP 20.93,22.33 20.93,23.18 U1.12
TH0+
  Bottom 0.152: TH0.1 23.57,13.65 arc31 22.79,15.42 arc38 13.05,21.43 arc11 10.92,21.7 6.39,21.73 6.12,22 arc2 J2.27
TH0-
  Bottom 0.152: J2.28 6.11,22.5 6.31,22.3 6.32,22.3 6.52,22.1 10.3,22.1 arc-8 11.95,21.98 arc-21 17.91,19.94 arc-23 24.46,14.29 arc-39 TH0.2
TRG_LED  (via drill 0.35)
  Top 0.152: D2.+ 31.26,30.45 31.26,31.13 | 31.26,31.13 | 31.26,31.13 31.26,31.4 | 31.26,31.4 | 31.26,31.4 31.26,32.07 20.21,43.11 TRG.+ 17.03,43.11 16.42,43.72 15.13,43.72 14.77,43.37 14.77,42.36 R6.2
  other vias: 30.95,30.14 17.46,43.11
TTL_RXD  (via drill 0.35)
  Top 0.152: v22,29.58 21.76,29.58 20,27.82 U1.26
  Bottom 0.152: RXD.TP 26.86,37.92 26.86,35.89 23.75,32.78 23.75,31.37 22,29.62 v22,29.58 21.65,29.23 21.61,29.23 21.49,29.11 17.47,29.11 16.87,29.71 16.11,29.71 15.58,29.18 15.58,28.36 15.01,27.79 6.62,27.79 6.41,28 J2.39
TTL_TXD  (via drill 0.35)
  Top 0.152: v22.14,30.62 22.12,30.62 19.55,28.05 U1.27
  Bottom 0.152: TXD.TP 25.48,39.07 25.48,38.06 26.55,36.98 26.55,36.02 23.45,32.91 23.45,31.93 v22.14,30.62 20.93,29.41 17.6,29.41 16.99,30.02 15.98,30.02 15.27,29.3 15.27,28.49 14.88,28.1 6.75,28.1 6.34,28.5 J2.40
V_FOL_PWM  (via drill 0.35)
  Top 0.152: U1.1 18.49,26.51 v18.49,27.62
  Bottom 0.152: v18.49,27.62 18.6,27.51 20.46,27.51 21.9,26.07 | 21.9,26.07 | 21.9,26.07 22.8,25.17 22.8,24.8 23.41,24.19 24.07,24.19 25.16,23.1 27.47,23.1 R10.2
  other vias: 27.73,22.84
V_FOL_SENSE  (via drill 0.35)
  Top 0.152: 22.36,25.55 U1.19 23.08,25.56 23.14,25.62 23.49,25.62 v23.8,25.93 | U4.8 v27.83,24.43 U4.7 | v26.76,29.36 R1.1
  Bottom 0.152: 23.8,26.12 v23.8,25.93 23.8,26.08 24.24,26.51 24.24,27.11 24.59,27.47 | 24.59,27.47 25.17,27.47 25.45,27.19 25.45,26.84 27.83,24.46 v27.83,24.43 | 24.59,27.47 24.59,28.21 24.65,28.27 24.65,29.55 24.99,29.88 26.23,29.88 v26.76,29.36
V_INT
  Bottom 0.152: C3.1 32.46,15.36 32.46,14.87 | J2.25 J2.26 | J2.24 J2.23
  Bottom 0.508: FAN1.2 34.46,18.36 34.46,16.87 32.46,14.87 31.81,14.22 30.75,14.22 | 30.75,14.22 29.9,15.07 FAN0.2 | 30.75,14.22 30.75,14.07 29.6,12.92 29.51,12.92 26.46,9.87 arc-138 21.46,11.87 arc1 21.46,14.87 arc44 21.04,15.87 20.08,16.83 arc40 11.7,20.7 5.69,20.7 J2.24
  Bottom 1.27: J2.24 J2.25
VCC  (via drill 0.55)
  Top 0.152: HE0.1 HE0.2
  Top 1.27: HE0.2 5.55,11.49 v5.49,11.56
  Bottom 0.152: J2.1 J2.2 J2.3 J2.4 J2.5 J2.6 v5.49,11.56 J2.7 J2.8 J2.9 J2.10 J2.11 J2.12
  Bottom 1.27: J2.2 v5.49,11.56 J2.11
VCC_REG  (via drill 0.35)
  Top 0.152: 5V.TP 14.02,10.63 5.19,10.63 4.09,11.73 4.09,13.84 | 4.09,13.84 v4.09,25.23 | 4.09,13.84 v7.63,13.84
  Top 0.406: v13.93,26.74 14.62,26.74 | 14.62,26.74 14.77,26.74 14.77,28.15 C2.2 | C2.2 | 14.62,26.74 14.62,26.65 F1.1 | C2.2 12.27,28.21 D1.P$2
  Top 0.508: 15.14,26.06 F1.1
  Bottom 0.152: J2.36 5.49,26.73 5.49,26.86 J2.37 | v4.09,25.23 v4.1,25.23 4.1,25.99 4.84,26.73 | C8.2 7.63,13.28 v7.63,13.84 7.63,15.11 8.52,16 R12.2 7.77,16.9 C10.2
  Bottom 0.406: v13.93,26.74 13.81,26.86 5.49,26.86 | 4.84,26.73 5.49,26.73
  other vias: 16.52,8.13
VCOMP_PWM
  Top 0.152: U1.11 20.45,21.51 R5.2
VCOMP_SENSE  (via drill 0.35)
  Top 0.152: U1.20 22.43,26.09 22.78,26.09 23.28,26.59 v23.28,26.69 23.89,26.69 23.92,26.66 24.84,26.66 | 16.3,21.05 16.45,21.2 C6.2 18.61,21.2 R5.1 | 16.3,21.05 C7.2 | v16.13,21.46 16.3,21.29 16.3,21.05 | U4.1 24.84,26.66 | v24.84,26.86 24.84,26.66
  Bottom 0.152: v23.28,26.69 22.89,26.69 22.73,26.53 21.87,26.53 20.21,28.19 16.27,28.19 13.67,25.59 13.67,23.93 v16.13,21.46 | ADJ+.TP 32.72,24.64 30.28,24.64 30.24,24.67 28.92,24.67 28.08,23.83 27.58,23.83 27.22,24.18 27.22,24.64 25,26.86 v24.84,26.86
VREF_IN
  Top 0.152: U4.9 28.79,22.98 R10.1 C4.2 28.64,20.57 C5.2
X_1A  (1 unrouted)
X_1B  (1 unrouted)
X_2A  (1 unrouted)
X_2B  (1 unrouted)
Z_MIN_TRIG  (via drill 0.35)
  Top 0.152: U1.9 19.55,22.46 19.38,22.29 19.38,20.39 arc-90 18.41,19.42 15.81,19.42 arc-40 13.67,20.07 13.65,20.07 10.64,23.07 10.37,23.35 v10.37,23.7 | 10.81,37.46 R6.1 10.81,37.47 10.81,36.7 6.36,32.26 6.36,27.4 v7.63,26.13 7.63,26.1
  Bottom 0.152: J2.35 7.51,26 v7.63,26.13 10.07,23.7 v10.37,23.7
Z_TRG
  Top 0.152: U1.28 19.1,28.43 INT.TP 21.87,31.24 23.13,31.24 23.34,31.03 R13.2

### Text on the board
tPlace: + -
bPlace: 2B 2A 1A 1B | + - | PZ1 | Fan1 | + - | Fan0 | + - | HE0 | + - | TH0